# Altium schematic sheet Power Supply and LEDs.SchDoc: Modular Parent Motherboard
size Letter; DrawnBy: MTAN; Organization: Altium Limited; DocumentNumber: 4; Revision: B; SheetNumber: 4; SheetTotal: 6
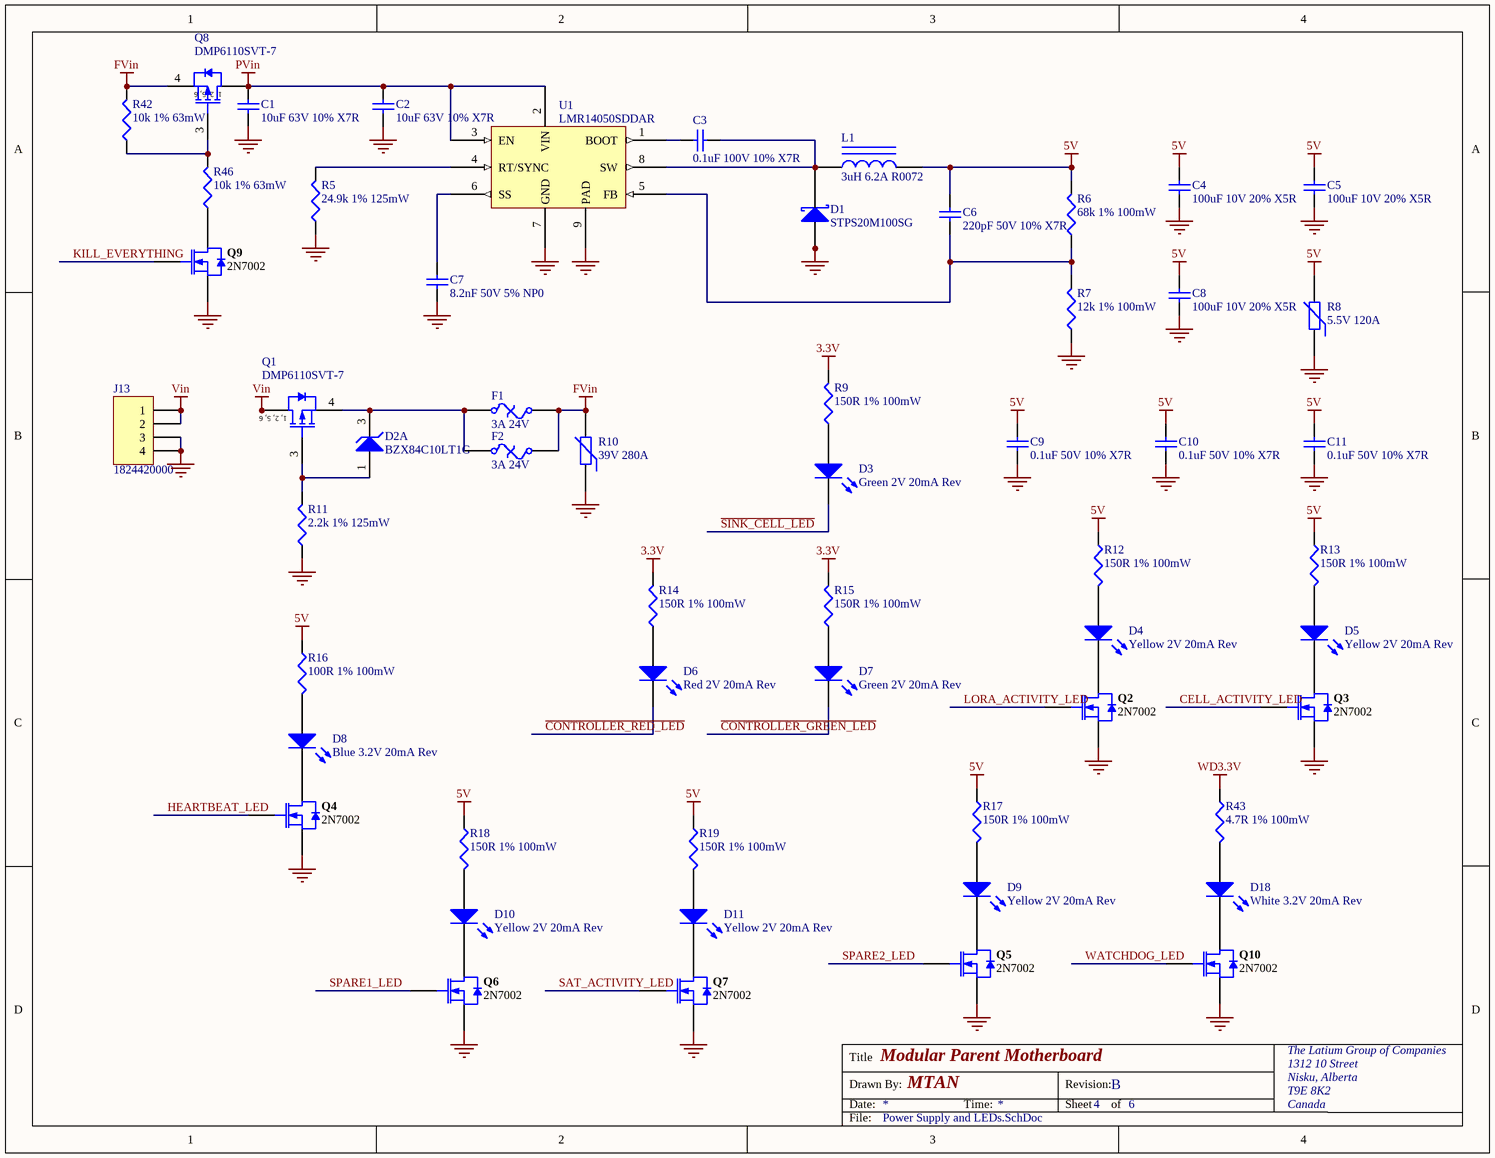
[diagram p0: Power Supply and LEDs.SchDoc]

## Parts
C1  10uF 63V 10% X7R  [C1210_L]
C2  10uF 63V 10% X7R  [C1210_L]
C3  0.1uF 100V 10% X7R  [C0805]
C4  100uF 10V 20% X5R  [C1210_L]
C5  100uF 10V 20% X5R  [C1210_L]
C6  220pF 50V 10% X7R  [1608[0603]]
C7  8.2nF 50V 5% NP0  [1608[0603]]
C8  100uF 10V 20% X5R  [C1210_L]
C9  0.1uF 50V 10% X7R  [CAPC1005L]
C10  0.1uF 50V 10% X7R  [CAPC1005L]
C11  0.1uF 50V 10% X7R  [CAPC1005L]
D1  STPS20M100SG  [ONSC-D2PAK-3-418AJ_A_V]
D2  BZX84C10LT1G  [SOT23-3_L]  (part A of 2)
D3  Green 2V 20mA Rev  [1206 Reverse LED]
D4  Yellow 2V 20mA Rev  [1206 Reverse LED]
D5  Yellow 2V 20mA Rev  [1206 Reverse LED]
D6  Red 2V 20mA Rev  [1206 Reverse LED]
D7  Green 2V 20mA Rev  [1206 Reverse LED]
D8  Blue 3.2V 20mA Rev  [1206 Reverse LED]
D9  Yellow 2V 20mA Rev  [1206 Reverse LED]
D10  Yellow 2V 20mA Rev  [1206 Reverse LED]
D11  Yellow 2V 20mA Rev  [1206 Reverse LED]
D18  White 3.2V 20mA Rev  [1206 Reverse LED]
F1  3A 24V  [2920]
F2  3A 24V  [2920]
J13  1824420000  [1824420000]
L1  3uH 6.2A R0072  [SRU1048]
Q1  DMP6110SVT-7  [SOT23-6_L]
Q2  2N7002  [INF-PG-SOT23_L]
Q3  2N7002  [INF-PG-SOT23_L]
Q4  2N7002  [INF-PG-SOT23_L]
Q5  2N7002  [INF-PG-SOT23_L]
Q6  2N7002  [INF-PG-SOT23_L]
Q7  2N7002  [INF-PG-SOT23_L]
Q8  DMP6110SVT-7  [SOT23-6_L]
Q9  2N7002  [INF-PG-SOT23_L]
Q10  2N7002  [INF-PG-SOT23_L]
R5  24.9k 1% 125mW  [6-0805_L]
R6  68k 1% 100mW  [J1-0603]
R7  12k 1% 100mW  [J1-0603]
R8  5.5V 120A  [6-0805_L]
R9  150R 1% 100mW  [RESC1608L]
R10  39V 280A  [RESC3225L]
R11  2.2k 1% 125mW  [6-0805_L]
R12  150R 1% 100mW  [RESC1608L]
R13  150R 1% 100mW  [RESC1608L]
R14  150R 1% 100mW  [RESC1608L]
R15  150R 1% 100mW  [RESC1608L]
R16  100R 1% 100mW  [RESC1608L]
R17  150R 1% 100mW  [RESC1608L]
R18  150R 1% 100mW  [RESC1608L]
R19  150R 1% 100mW  [RESC1608L]
R42  10k 1% 63mW  [RESC1005L]
R43  4.7R 1% 100mW  [RESC1608L]
R46  10k 1% 63mW  [RESC1005L]
U1  LMR14050SDDAR  [MRA08A_L]

## Nets
3.3V: R9.2 R14.2 R15.2
5V: C4.2 C5.2 C6.2 C8.2 C9.1 C10.1 C11.1 L1.2 R6.2 R8.2 R12.1 R13.1 R16.1 R17.1 R18.1 R19.1
FVin: F1.2 F2.2 Q8.4(S) R10.2 R42.2
GND: C1.1 C2.1 C4.1 C5.1 C7.1 C8.1 C9.2 C10.2 C11.2 D1.1(A) D1.3(A) J13.3 J13.4 Q2.2(SOURCE) Q3.2(SOURCE) Q4.2(SOURCE) Q5.2(SOURCE) Q6.2(SOURCE) Q7.2(SOURCE) Q9.2(SOURCE) Q10.2(SOURCE) R5.1 R7.1 R8.1 R10.1 R11.1 U1.7(GND) U1.9(PAD)
PVin: C1.2 C2.2 Q8.1(D) Q8.2(D) Q8.5(D) Q8.6(D) U1.2(VIN) U1.3(EN)
Vin: J13.1 J13.2 Q1.1(D) Q1.2(D) Q1.5(D) Q1.6(D)
WD3.3V: R43.1
~{CONTROLLER_GREEN_LED}: D7.2(K)
~{CONTROLLER_RED_LED}: D6.2(K)
CELL_ACTIVITY_LED: Q3.1(GATE)
HEARTBEAT_LED: Q4.1(GATE)
KILL_EVERYTHING: Q9.1(GATE)
LORA_ACTIVITY_LED: Q2.1(GATE)
~{SINK_CELL_LED}: D3.2(K)
SAT_ACTIVITY_LED: Q7.1(GATE)
SPARE1_LED: Q6.1(GATE)
SPARE2_LED: Q5.1(GATE)
WATCHDOG_LED: Q10.1(GATE)
NetC3_1: C3.1 D1.4(K) L1.1 U1.8(SW)
NetC3_2: C3.2 U1.1(BOOT)
NetC6_1: C6.1 R6.1 R7.2 U1.5(FB)
NetC7_2: C7.2 U1.6(SS)
NetD2_1: D2.1(A) Q1.3(G) R11.2
NetD2_3: D2.3(K) F1.1 F2.1 Q1.4(S)
NetD3_1: D3.1(A) R9.1
NetD4_1: D4.1(A) R12.2
NetD4_2: D4.2(K) Q2.3(DRAIN)
NetD5_1: D5.1(A) R13.2
NetD5_2: D5.2(K) Q3.3(DRAIN)
NetD6_1: D6.1(A) R14.1
NetD7_1: D7.1(A) R15.1
NetD8_1: D8.1(A) R16.2
NetD8_2: D8.2(K) Q4.3(DRAIN)
NetD9_1: D9.1(A) R17.2
NetD9_2: D9.2(K) Q5.3(DRAIN)
NetD10_1: D10.1(A) R18.2
NetD10_2: D10.2(K) Q6.3(DRAIN)
NetD11_1: D11.1(A) R19.2
NetD11_2: D11.2(K) Q7.3(DRAIN)
NetD18_1: D18.1(A) R43.2
NetD18_2: D18.2(K) Q10.3(DRAIN)
NetQ8_3: Q8.3(G) R42.1 R46.2
NetQ9_3: Q9.3(DRAIN) R46.1
NetR5_2: R5.2 U1.4(RT/SYNC)

## Notes on the sheet
- Title
- Drawn By:
- Date:
- Time:
- Revision:
- Sheet
- of
- The Latium Group of Companies
- 1312 10 Street
- Nisku, Alberta
- T9E 8K2
- Canada
- File:
- (in symbol NTGS3136PT1G) 1, 2, 5, 6

## Library data of the parts
C1-C11 = Cap: Capacitor
  C1 C2: Value: 10uF 63V 10% X7R
  C3: Value: 0.1uF 100V 10% X7R
  C4 C5 C8: Value: 100uF 10V 20% X5R
  C6: Value: 220pF 50V 10% X7R
  C7: Value: 8.2nF 50V 5% NP0
  C9-C11: Value: 0.1uF 50V 10% X7R
D1 = BAS70: DIODE SCHOTTKY 100V 20A D2PAK; Manufacturer: STMicroelectronics; ComponentLink2Description: Datasheet; ComponentLink2URL: S:\Hardware\Data Sheets\Passive\Diodes\STPS20M100.pdf; Value: STPS20M100SG; Manufacturer Part Number: STPS20M100SG; Supplier 1: Digi-Key; Supplier 1 Part Number: 497-10993-1-ND
D2 = BZX84C10LT1G: DIODE ZENER 10V 225MW SOT23-3; Manufacturer: On Semiconductor; Supplier 1: Digi-Key; Supplier 1 Part Number: BZX84C10LT1GOSCT-ND; ComponentLink1Description: Data Sheet; ComponentLink1URL: S:\Hardware\Data Sheets\Passive\Diodes\BZX84C2V4LT1-D.pdf; Value: BZX84C10LT1G; Manufacturer Part Number: BZX84C10LT1G
D3 D7 = LED2: LED GRN CLEAR 2SMD BOTTOM ENTRY; Manufacturer: Wurth Electronics Inc; Manufacturer Part Number: 156120VS82500; Value: Green 2V 20mA Rev; Supplier 1: Digi-Key; Supplier 1 Part Number: 732-11424-1-ND
D4 D5 D9-D11 = LED2: LED YELLOW CLEAR 2SMD; Manufacturer: Wurth Electronics Inc; Manufacturer Part Number: 156120YS82500; Value: Yellow 2V 20mA Rev; Supplier 1: Digi-Key; Supplier 1 Part Number: 732-11425-1-ND
D6 = LED2: LED RED CLEAR 2SMD BOTTOM ENTRY; Manufacturer: Wurth Electronics Inc; Manufacturer Part Number: 156120RS82500; Value: Red 2V 20mA Rev; Supplier 1: Digi-Key; Supplier 1 Part Number: 732-11422-1-ND
D8 = LED2: LED BLUE CLEAR 2SMD BOTTOM ENTRY; Manufacturer: Wurth Electronics Inc; Manufacturer Part Number: 156120BS82500; Value: Blue 3.2V 20mA Rev; Supplier 1: Digi-Key; Supplier 1 Part Number: 732-11420-1-ND
D18 = LED2: LED WHITE CLEAR 1204 SMD; Manufacturer: Inolux; Manufacturer Part Number: IN-S124BRUW; Value: White 3.2V 20mA Rev; Supplier 1: Digi-Key; Supplier 1 Part Number: 1830-1126-1-ND
F1 F2 = Fuse Thermal: Thermal Fuse; Manufacturer Part Number: SMDC300F/24-2; Manufacturer: Littelfuse Inc; Value: 3A 24V; Supplier 1: Digi-Key; Supplier 1 Part Number: SMDC300F/24-2CT-ND
J13 = Header 4H: TERM BLK 2POS SIDE ENT 3.5MM PCB; Manufacturer: Weidmuller; Value: 1824420000; Manufacturer Part Number: 1824420000; Supplier 1: Digi-Key; Supplier 1 Part Number: 281-2020-ND
L1 = Inductor Iron: FIXED IND 3UH 6.2A 7.2 MOHM SMD; Manufacturer Part Number: SRU1048-3R0Y; Manufacturer: Bourns Inc; Value: 3uH 6.2A R0072; Supplier 1: Digi-Key; Supplier 1 Part Number: SRU1048-3R0YCT-ND; ComponentLink1Description: Data Sheet; ComponentLink1URL: S:\Hardware\Data Sheets\Passive\Inductors\SRU1048.pdf
Q1 Q8 = NTGS3136PT1G: MOSFET P-CH 60V TSOT26; Manufacturer: Diodes Incorporated; ComponentLink1Description: Data Sheet; ComponentLink1URL: S:\Hardware\Data Sheets\Passive\FETs\DMP6110SVT.pdf; Value: DMP6110SVT-7; Manufacturer Part Number: DMP6110SVT-7; Supplier 1: Digi-Key; Supplier 1 Part Number: DMP6110SVT-7DICT-ND
Q2-Q7 Q9 Q10 = 2N7002: MOSFET N-CH 60V 115MA SOT-23; Manufacturer: ON Semiconductor; ComponentLink1Description: Data Sheet; ComponentLink1URL: S:\Hardware\Data Sheets\Active\Transistors\FETs\NDS7002A-D.pdf; Manufacturer Part Number: 2N7002; Value: 2N7002; Supplier 1: Digi-Key; Supplier 1 Part Number: 2N7002NCT-ND
R5-R7 R9 R11-R19 R42 R43 R46 = Res3: Resistor
  R5: Value: 24.9k 1% 125mW
  R6: Value: 68k 1% 100mW
  R7: Value: 12k 1% 100mW
  R9 R12-R15 R17-R19: Value: 150R 1% 100mW
  R11: Value: 2.2k 1% 125mW
  R16: Value: 100R 1% 100mW
  R42 R46: Value: 10k 1% 63mW
  R43: Value: 4.7R 1% 100mW
R8 = Res Varistor: VARISTOR 8.2V 120A 0805; Manufacturer: Littelfuse Inc; Manufacturer Part Number: V5.5MLA0805H; Value: 5.5V 120A; Supplier 1: Digi-Key; Supplier 1 Part Number: F2215CT-ND
R10 = Res Varistor: VARISTOR 39V 280A 1210; Manufacturer: Littelfuse Inc; Manufacturer Part Number: V30MLA1210NH; Value: 39V 280A; Supplier 1: Digi-Key; Supplier 1 Part Number: F3825CT-ND
U1 = LMR14050: IC REG BUCK ADJUSTABLE 5A 8SOPWR; Manufacturer: Texas Instruments; Value: LMR14050SDDAR; Manufacturer Part Number: LMR14050SDDAR; Supplier 1: Digi-Key; Supplier 1 Part Number: 296-44322-1-ND; ComponentLink1Description: Data Sheet; ComponentLink1URL: S:\Hardware\Data Sheets\Active\Voltage Regulators\lmr14050.pdf